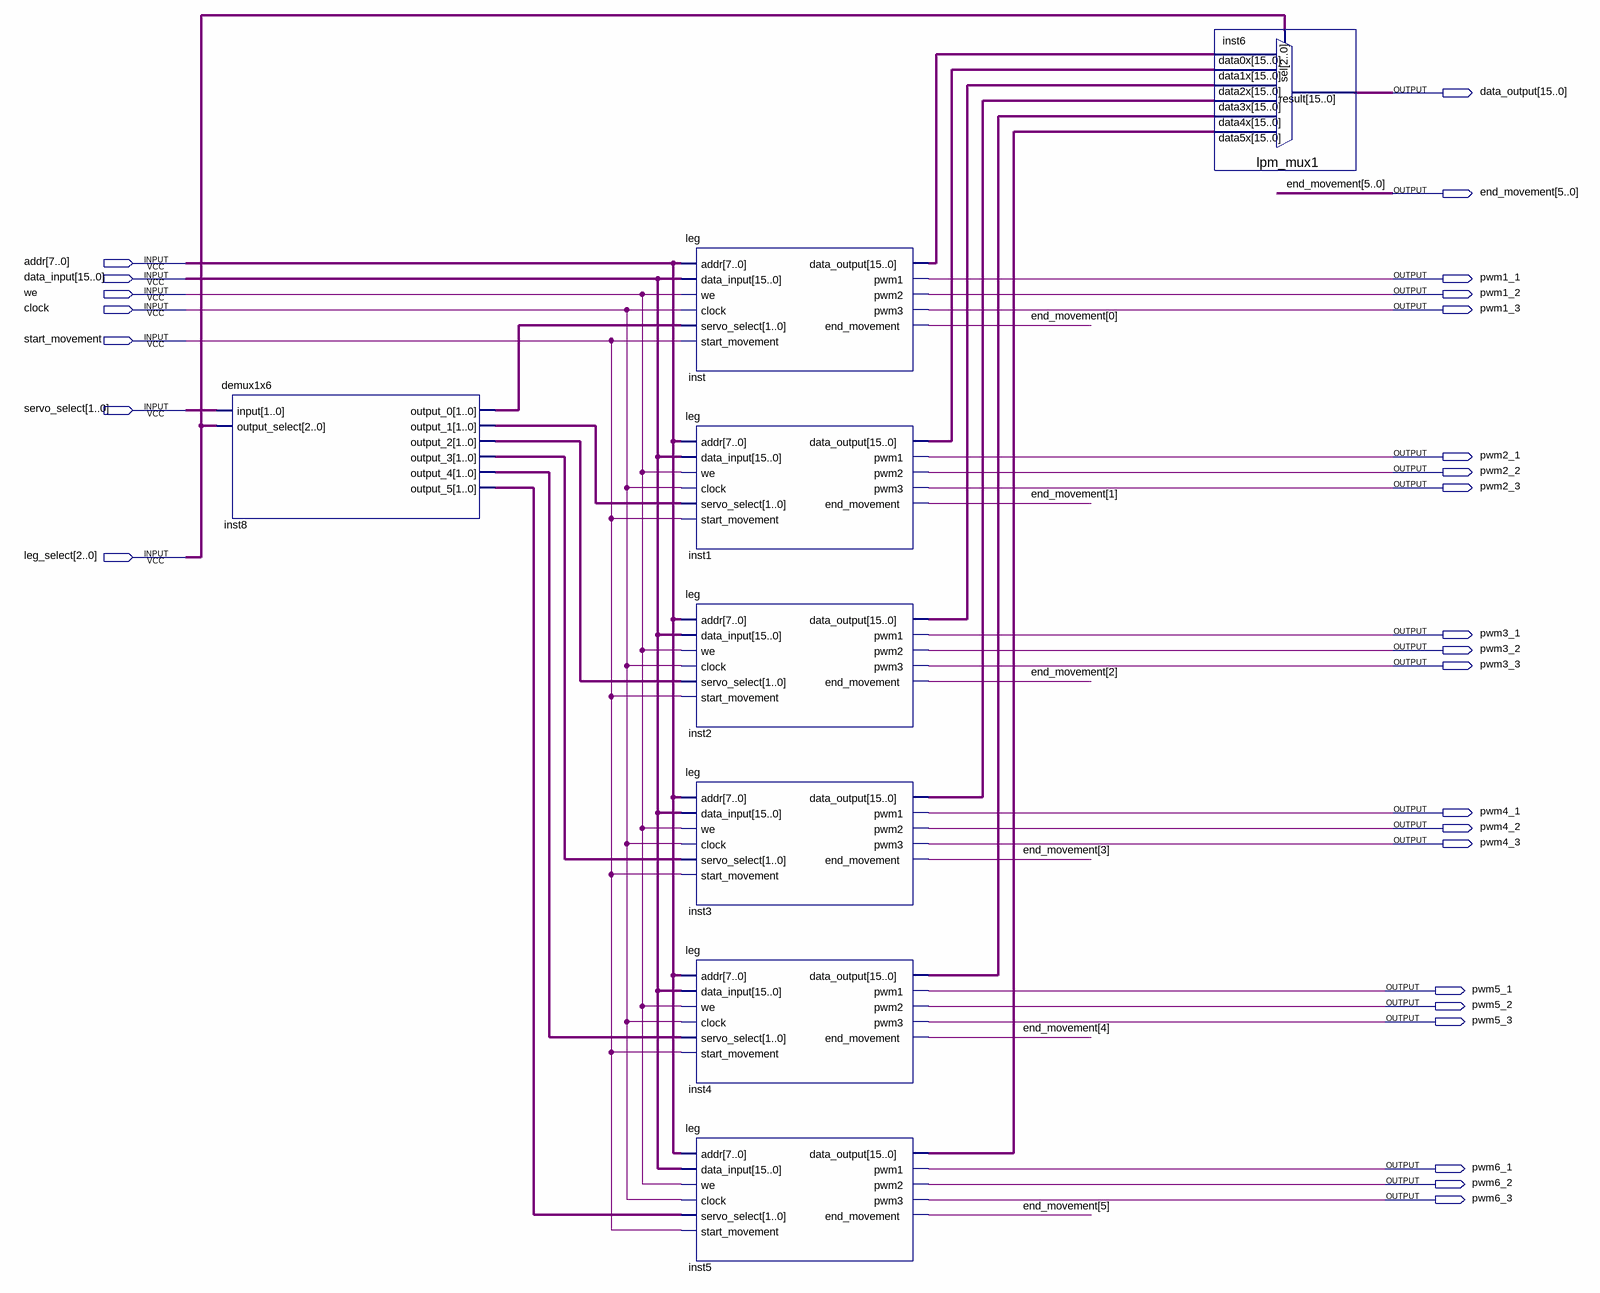
[diagram p0: schematic sheet]
// Quartus schematic full_bot.bdf as structural Verilog: 8 symbols, 27 pins
module full_bot (
  input  [7:0] addr,
  input  [15:0] data_input,
  input  we,
  input  clock,
  input  start_movement,
  input  [1:0] servo_select,
  input  [2:0] leg_select,
  output [15:0] data_output,
  output [5:0] end_movement,
  output pwm1_1,
  output pwm1_2,
  output pwm1_3,
  output pwm2_1,
  output pwm2_2,
  output pwm2_3,
  output pwm3_1,
  output pwm3_2,
  output pwm3_3,
  output pwm4_1,
  output pwm4_2,
  output pwm4_3,
  output pwm5_1,
  output pwm5_2,
  output pwm5_3,
  output pwm6_1,
  output pwm6_2,
  output pwm6_3
);

  wire [1:0] inst8_output_0, inst8_output_1, inst8_output_2, inst8_output_3, inst8_output_4, inst8_output_5;
  wire [15:0] inst1_data_output, inst2_data_output, inst3_data_output, inst4_data_output, inst5_data_output,
       inst_data_output;

  demux1x6 inst8 (
    .\input (servo_select), .output_select(leg_select), .output_0(inst8_output_0), .output_1(inst8_output_1),
    .output_2(inst8_output_2), .output_3(inst8_output_3), .output_4(inst8_output_4), .output_5(inst8_output_5));
  leg inst (
    .addr(addr), .data_input(data_input), .we(we), .clock(clock), .servo_select(inst8_output_0),
    .start_movement(start_movement), .data_output(inst_data_output), .pwm1(pwm1_1), .pwm2(pwm1_2),
    .pwm3(pwm1_3), .end_movement(end_movement[0]));
  leg inst1 (
    .addr(addr), .data_input(data_input), .we(we), .clock(clock), .servo_select(inst8_output_1),
    .start_movement(start_movement), .data_output(inst1_data_output), .pwm1(pwm2_1), .pwm2(pwm2_2),
    .pwm3(pwm2_3), .end_movement(end_movement[1]));
  leg inst2 (
    .addr(addr), .data_input(data_input), .we(we), .clock(clock), .servo_select(inst8_output_2),
    .start_movement(start_movement), .data_output(inst2_data_output), .pwm1(pwm3_1), .pwm2(pwm3_2),
    .pwm3(pwm3_3), .end_movement(end_movement[2]));
  leg inst3 (
    .addr(addr), .data_input(data_input), .we(we), .clock(clock), .servo_select(inst8_output_3),
    .start_movement(start_movement), .data_output(inst3_data_output), .pwm1(pwm4_1), .pwm2(pwm4_2),
    .pwm3(pwm4_3), .end_movement(end_movement[3]));
  leg inst4 (
    .addr(addr), .data_input(data_input), .we(we), .clock(clock), .servo_select(inst8_output_4),
    .start_movement(start_movement), .data_output(inst4_data_output), .pwm1(pwm5_1), .pwm2(pwm5_2),
    .pwm3(pwm5_3), .end_movement(end_movement[4]));
  leg inst5 (
    .addr(addr), .data_input(data_input), .we(we), .clock(clock), .servo_select(inst8_output_5),
    .start_movement(start_movement), .data_output(inst5_data_output), .pwm1(pwm6_1), .pwm2(pwm6_2),
    .pwm3(pwm6_3), .end_movement(end_movement[5]));
  lpm_mux1 inst6 (
    .data5x(inst5_data_output), .data4x(inst4_data_output), .data3x(inst3_data_output),
    .data2x(inst2_data_output), .data1x(inst1_data_output), .data0x(inst_data_output), .sel(leg_select),
    .result(data_output));
endmodule
